# EAGLE design JST2 (EAGLE 6.4)
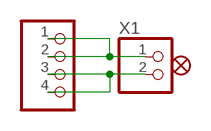
[diagram p0: schematic, sheet 1]

## Parts
FID1  FIDUCIAL""  [FIDUCIAL_1MM]
JP1  PADS-4  [PADS-4]
X1  CON_JST_PH_2PIN  [JSTPH2]

## Nets
N$2: JP1.1 JP1.2 X1.1
N$3: JP1.3 JP1.4 X1.2

## Library data of the parts
FID1 = microbuilder:FIDUCIAL: Fiducial Alignment Points Various fiducial points for machine vision alignment.; BOM: EXCLUDE
JP1 = breakouts:PADS-4: PIN HEADER
X1 = microbuilder:CON_JST_PH_2PIN: JST 2-Pin Right-Angle Connector PH-Series - 4UConnector: 17311 SH-Series - 4UConnector: 07278

## Board
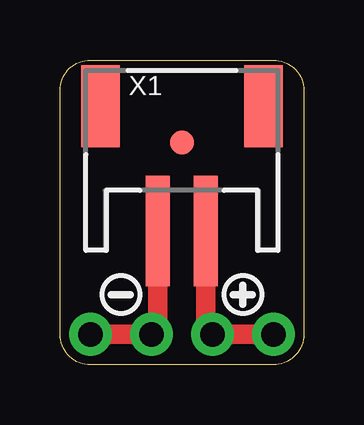
[diagram p1: board, top side]
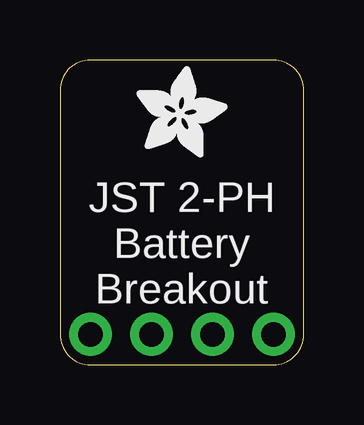
[diagram p2: board, bottom side, seen from below]

Size 10.16 x 12.7 mm. Coordinates in mm from the lower left corner, seen from the top.
Outline: 0,1.27 0,11.43 arc-90 1.27,12.7 8.89,12.7 arc-90 10.16,11.43 10.16,1.27 arc-90 8.89,0 1.27,0 arc-90 0,1.27
Copper layers (1*16): Top 0.035mm / dielectric 1.5mm / Bottom 0.035mm
Design rules "default": minimum track width 10mil, minimum drill 16mil, track to track 8mil, track to pad 8mil, pad to pad 8mil, via to via 8mil, smd to smd 8mil, copper to edge 10mil, drill to drill 8mil, minimum pad ring 10mil, minimum via ring 8mil, stop-mask expansion 4mil, vias tented up to drill 20mil, thermal gap 10mil

### Footprints (pad centres in the part's own frame; a part is rotated, then mirrored left to right if it is on the bottom)
FIDUCIAL_1MM = smd 1 x 1: 1 0,0
PADS-4 = drill 1.016 pad 1.778: 1 -3.81,0; 2 -1.27,0; 3 1.27,0; 4 3.81,0
JSTPH2 = smd 1 x 4.6: 1 -1,-3.7; 2 1,-3.7 | smd 1.6 x 3.4: NC1 -3.4,1.5; NC2 3.4,1.5

### Placement (x,y rotation side)
FID1  5.08,9.27 0 top
JP1  5.08,1.27 0 top
U$1  [SYMBOL_PLUS]  7.62,2.92 0 top
U$2  [SYMBOL_MINUS]  2.54,2.92 0 top
U$4  [ADAFRUIT_3.5MM]  6.99,8.64 0 bottom
X1  5.08,9.27 0 top

### Tracks (layer width: path | path; a pad name or v marks a point on that pad's centre or on a via)
N$2
  Top 0.813: X1.1 4.08,1.54 JP1.2 JP1.1
N$3
  Top 0.813: X1.2 6.08,1.54 JP1.3 JP1.4

### Text on the board
bPlace: JST 2-PH / Battery / Breakout